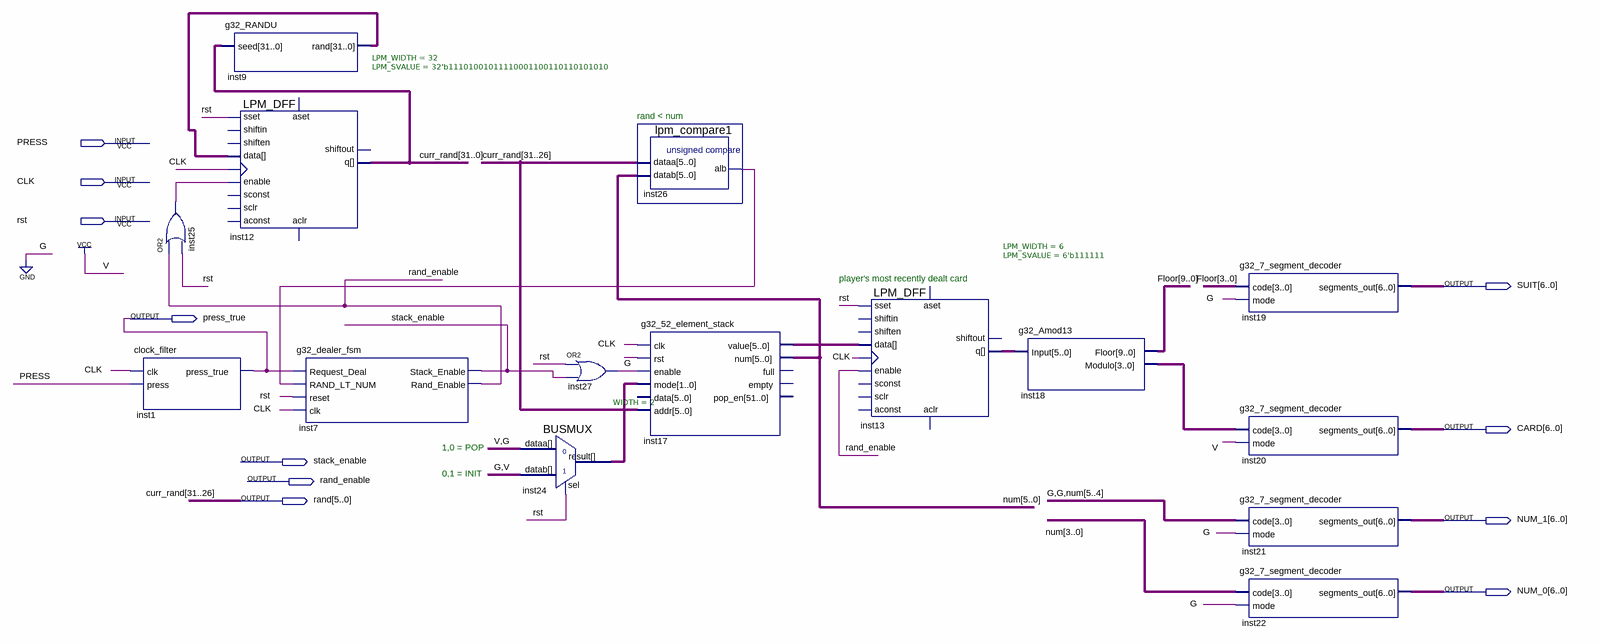
[diagram p0: schematic sheet]
// Quartus schematic g32_dealer_fsm_testbed.bdf as structural Verilog: 15 symbols, 11 pins
module g32_dealer_fsm_testbed (
  input  PRESS,
  input  CLK,
  input  rst,
  output [6:0] SUIT,
  output press_true,
  output [6:0] CARD,
  output stack_enable,
  output rand_enable,
  output [5:0] \rand ,
  output [6:0] NUM_1,
  output [6:0] NUM_0
);

  wire inst25_out, inst26_alb, inst27_out;
  wire [1:0] inst24_result;
  wire [3:0] inst18_modulo;
  wire [5:0] inst13_q, inst17_value, num;
  wire [9:0] Floor;
  wire [25:0] curr_rand;
  wire [31:0] inst9_rand;

  clock_filter inst1 (.clk(CLK), .press(PRESS), .press_true(press_true));
  or inst25 (inst25_out, rand_enable, rst);
  g32_RANDU inst9 (.seed({\rand , curr_rand}), .\rand (inst9_rand));
  LPM_DFF #(.LPM_WIDTH(32), .LPM_SVALUE(32'b11101001011110001100110110101010)) inst12 (
    .enable(inst25_out), .clock(CLK), .data(inst9_rand), .sset(rst), .q({\rand , curr_rand}));  // open: shiftin, shiften, aconst, sclr, sconst, aset, aclr, shiftout
  g32_dealer_fsm inst7 (
    .Request_Deal(press_true), .RAND_LT_NUM(inst26_alb), .reset(rst), .clk(CLK), .Stack_Enable(stack_enable),
    .Rand_Enable(rand_enable));
  or inst27 (inst27_out, rst, stack_enable);
  BUSMUX #(.WIDTH(2)) inst24 (.dataa(2'b10), .datab(2'b01), .sel(rst), .result(inst24_result));
  lpm_compare1 inst26 (.dataa(\rand ), .datab(num), .alb(inst26_alb));
  g32_52_element_stack inst17 (
    .clk(CLK), .rst(1'b0), .enable(inst27_out), .mode(inst24_result), .addr(\rand ), .value(inst17_value),
    .num(num));  // open: data, full, empty, pop_en
  LPM_DFF #(.LPM_WIDTH(6), .LPM_SVALUE(6'b111111)) inst13 (
    .enable(rand_enable), .clock(CLK), .data(inst17_value), .sset(rst), .q(inst13_q));  // open: shiftin, shiften, aconst, sclr, sconst, aset, aclr, shiftout
  g32_Amod13 inst18 (.Input(inst13_q), .Floor(Floor), .Modulo(inst18_modulo));
  g32_7_segment_decoder inst19 (.code(Floor[3:0]), .mode(1'b0), .segments_out(SUIT));
  g32_7_segment_decoder inst20 (.code(inst18_modulo), .mode(1'b1), .segments_out(CARD));
  g32_7_segment_decoder inst21 (.code({2'b00, num[5:4]}), .mode(1'b0), .segments_out(NUM_1));
  g32_7_segment_decoder inst22 (.code(num[3:0]), .mode(1'b0), .segments_out(NUM_0));

  // Other names for the same wires on the sheet: curr_rand[31:26] = \rand 

  // Notes on the sheet:
  //   rand < num
  //   player's most recently dealt card
  //   1,0 = POP
  //   0,1 = INIT
endmodule
